# EAGLE design wifi-amp (EAGLE 7.1.0)
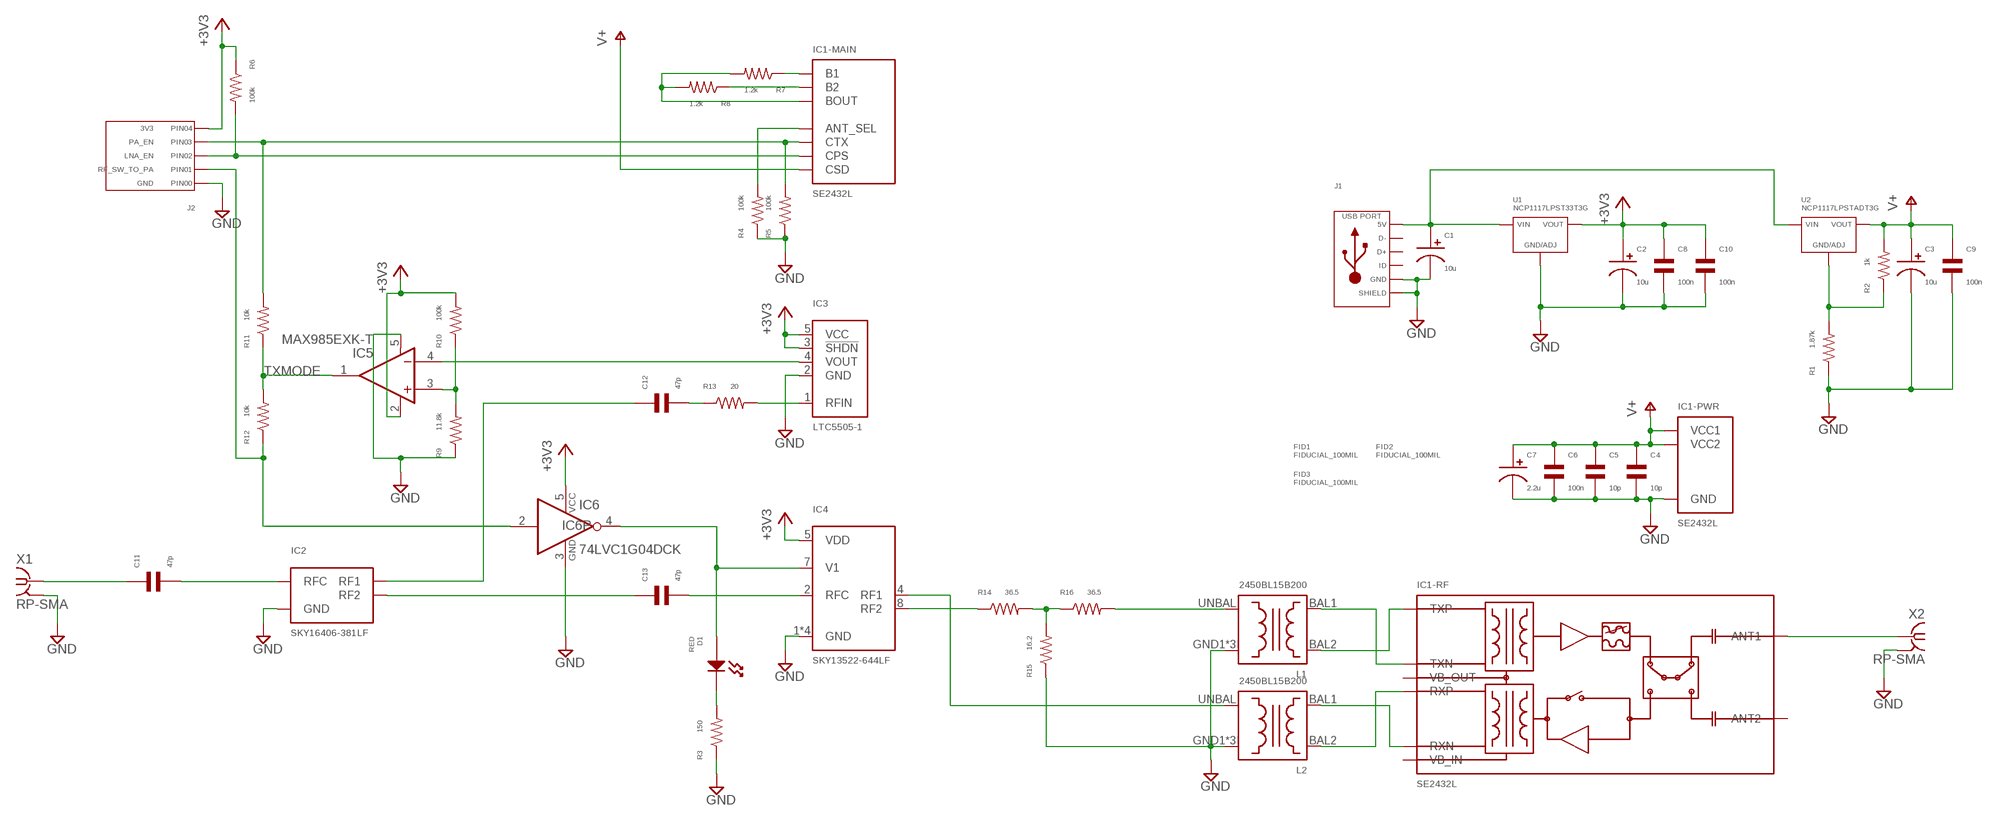
[diagram p0: schematic, sheet 1]

## Parts
C1  10u  CAPACITOR_P_4MM  [CP4MM]
C2  10u  CAPACITOR_P_4MM  [CP4MM]
C3  10u  CAPACITOR_P_4MM  [CP4MM]
C4  10p  CAPACITOR_NP_0402  [C0402]
C5  10p  CAPACITOR_NP_0402  [C0402]
C6  100n  CAPACITOR_NP_0402  [C0402]
C7  2.2u  CAPACITOR_P_4MM  [CP4MM]
C8  100n  CAPACITOR_NP_0402  [C0402]
C9  100n  CAPACITOR_NP_0402  [C0402]
C10  100n  CAPACITOR_NP_0402  [C0402]
C11  47p  CAPACITOR_NP_0402  [C0402]
C12  47p  CAPACITOR_NP_0402  [C0402]
C13  47p  CAPACITOR_NP_0402  [C0402]
D1  RED  LED_SINGLE_0603  [LED0603]
FID1  FIDUCIAL_100MIL  [FIDUCIAL_100MIL]
FID2  FIDUCIAL_100MIL  [FIDUCIAL_100MIL]
FID3  FIDUCIAL_100MIL  [FIDUCIAL_100MIL]
IC1  SE2432L  [24QFN]
IC2  SKY16406-381LF  [DFN6]
IC3  LTC5505-1  LTC5505  [SOT23-5]
IC4  SKY13522-644LF  [QFN8]
IC5  MAX985EXK-T  MAX986EXK-T  [SC70-5L]
IC6  74LVC1G04DCK  [SC70-5]
J1  USB_MICRO_RIGHT  [MICROUSB-RIGHT]
J2  HEADER_01X05_PTH_2.54MM  [PTH_2.54MM_01X05]
L1  2450BL15B200  [2450BL15B200]
L2  2450BL15B200  [2450BL15B200]
R1  1.87k  RESISTOR_0805  [R0805]
R2  1k  RESISTOR_0805  [R0805]
R3  150  RESISTOR_0402  [R0402]
R4  100k  RESISTOR_0402  [R0402]
R5  100k  RESISTOR_0402  [R0402]
R6  100k  RESISTOR_0402  [R0402]
R7  1.2k  RESISTOR_0402  [R0402]
R8  1.2k  RESISTOR_0402  [R0402]
R9  11.8k  RESISTOR_0402  [R0402]
R10  100k  RESISTOR_0402  [R0402]
R11  10k  RESISTOR_0402  [R0402]
R12  10k  RESISTOR_0402  [R0402]
R13  20  RESISTOR_0402  [R0402]
R14  36.5  RESISTOR_0402  [R0402]
R15  16.2  RESISTOR_0402  [R0402]
R16  36.5  RESISTOR_0402  [R0402]
U1  NCP1117LPST33T3G  [SOT-223-3]
U2  NCP1117LPSTADT3G  [SOT-223-3]
X1  RP-SMA  BU-SMA-H  [BU-SMA-H]
X2  RP-SMA  BU-SMA-H  [BU-SMA-H]

## Nets
+3V3: C2.P$1 C8.P$1 C10.P$1 IC3.3(!SHDN) IC3.5(VCC) IC4.5(VDD) IC5.2(V+) IC6.5(VCC) J2.P$5(PIN4) R6.P$1 R10.P$2 U1.P$1(VOUT) U1.P$3(VOUT)
+5V: C1.P$1 J1.1(5V) U1.P$4(VIN) U2.P$4(VIN)
ANT_SEL: IC1.ANT_SEL(-MAIN:ANT_SEL) R4.P$2
CPS: IC1.CPS(-MAIN:CPS) J2.P$3(PIN2) R6.P$2
CTX: IC1.CTX(-MAIN:CTX) J2.P$4(PIN3) R5.P$2 R11.P$2
GND: C1.P$2 C2.P$2 C3.P$2 C4.P$2 C5.P$2 C6.P$2 C7.P$2 C8.P$2 C9.P$2 C10.P$2 IC1.GND1(-PWR:GND) IC1.GND2(-PWR:GND) IC1.GND3(-PWR:GND) IC1.GND4(-PWR:GND) IC1.GND5(-PWR:GND) IC1.GND6(-PWR:GND) IC1.GND7(-PWR:GND) IC1.GND8(-PWR:GND) IC1.GND9(-PWR:GND) IC1.GND10(-PWR:GND) IC2.GND1(GND) IC2.GND2(GND) IC2.GND3(GND) IC2.GNDP(GND) IC3.2(GND) IC4.1(GND) IC4.3(GND) IC4.6(GND) IC4.EP(GND) IC5.5(V-) IC6.3(GND) J1.5(GND) J1.S1(SLD) J1.S2(SLD) J1.S3(SLD) J1.S4(SLD) J1.S5(SLD) J1.S6(SLD) J1.S7(SLD) J1.S8(SLD) J2.P$1(PIN0) L1.GND1(GND) L1.GND2(GND) L1.GND3(GND) L2.GND1(GND) L2.GND2(GND) L2.GND3(GND) R1.P$1 R3.P$1 R4.P$1 R5.P$1 R9.P$1 R15.P$1 U1.P$2(GND/ADJ) X1.2 X1.3 X1.4 X1.5 X2.2 X2.3 X2.4 X2.5
N$1: C11.P$1 X1.1
N$2: R1.P$2 R2.P$1 U2.P$2(GND/ADJ)
N$3: D1.CATHODE R3.P$2
N$4: IC1.B1(-MAIN:B1) R7.P$1
N$5: IC1.B2(-MAIN:B2) R8.P$1
N$6: IC1.BOUT(-MAIN:BOUT) R7.P$2 R8.P$2
N$7: IC1.ANT1(-RF:ANT1) X2.1
N$8: IC3.1(RFIN) R13.P$2
N$9: IC1.TXN(-RF:TXN) L1.BAL1
N$10: IC1.TXP(-RF:TXP) L1.BAL2
N$11: IC1.RXP(-RF:RXP) L2.BAL2
N$12: IC1.RXN(-RF:RXN) L2.BAL1
N$13: C11.P$2 IC2.RFC
N$14: C12.P$2 R13.P$1
N$15: IC4.4(RF1) L2.UNBAL
N$16: C12.P$1 IC2.RF1
N$17: C13.P$1 IC2.RF2
N$18: R14.P$2 R15.P$2 R16.P$1
N$20: IC3.4(VOUT) IC5.4(-IN)
N$21: IC5.3(+IN) R9.P$2 R10.P$1
N$22: L1.UNBAL R16.P$2
N$23: IC4.8(RF2) R14.P$1
N$24: C13.P$2 IC4.2(RFC)
N$25: D1.ANODE IC4.7(V1) IC6.4(O)
RF_SW_TO_PA: IC6.2(I) J2.P$2(PIN1) R12.P$1
TXMODE: IC5.1(OUT) R11.P$1 R12.P$2
V+: C3.P$1 C4.P$1 C5.P$1 C6.P$1 C7.P$1 C9.P$1 IC1.CSD(-MAIN:CSD) IC1.VCC1(-PWR:VCC1) IC1.VCC2(-PWR:VCC2) R2.P$2 U2.P$1(VOUT) U2.P$3(VOUT)
Unconnected: IC1.ANT2(-RF:ANT2) IC1.VB_IN(-RF:VB_IN) IC1.VB_OUT(-RF:VB_OUT) J1.2(D-) J1.3(D+) J1.4(ID)

## Library data of the parts
C1-C3 C7 = MF_Passives:CAPACITOR_P: Library: MF_Passives Description: Device for Polarized Capacitors. Manufacture part number (MFG#), Voltage Rating, and Tolerance can be added via Attributes.; MFG#: N/A; TOLERANCE: N/A; VOLTAGE: N/A
C4-C6 C8-C13 = MF_Passives:CAPACITOR_NP: Library: MF_Passives Description: Device for Non-Polarized Capacitors. Manufacture part number (MFG#), Voltage, Temperature Coefficient, and Tolerance can be added via Attributes.; MFG#: N/A; TEMP_COF: N/A; TOLERANCE: N/A; VOLTAGE: N/A
D1 = MF_LEDs:LED_SINGLE: Library: MF_LEDs Description: Device for Single LED Packages. Manufacture part number (MFG#) can be added via Attributes.; MFG#: N/A
FID1-FID3 = MF_Aesthetics:FIDUCIAL: Library: MF_Aesthetics Description: Fiducial marking for PCB alignment inside PNP and other machines.
IC1 = se2432l:SE2432L
IC2 = SKY16406-381LF:SKY16406-381LF
IC3 = LTC5505:LTC5505
IC4 = SKY13522-644LF:SKY13522-644LF
IC5 = maxim:MAX98*: Micropower, Low-Voltage Rail-to-Rail I/O Comparators Source: http://pdfserv.maxim-ic.com/en/ds/MAX985-MAX994.pdf; MPN: MAX986EXK+T; OC_FARNELL: unknown; OC_NEWARK: 67K7108
IC6 = 74xx-little-us:74*1G04: INVERTER Gate
J1 = MF_Connectors:USB: Library: MF_Connectors Description: 5 Pin USB Connectors. SLD is the shield connection. Usually tied to ground through a small ferrite bead.
J2 = MF_Connectors:HEADER_01X05: Library: MF_Connectors Description: Header Connector with 5 Positions and 01 Rows. Use the LABEL Attribute to label the pin on the schematic and PCB. You can remove the attributes on the PCB by using the SMASH function on the part and then deleting the text.; LABEL00: GND; LABEL01: RF_SW_TO_PA; LABEL02: LNA_EN; LABEL03: PA_EN; LABEL04: 3V3
L1 L2 = 2450BL15B200:2450BL15B200
R1-R3 R7-R10 R13-R16 = MF_Passives:RESISTOR: Library: MF_Passives Description: Device for Resistors. Manufacture part number (MFG#), Voltage, Tolerance, and Wattage Rating can be added via Attributes.; MFG#: N/A; TOLERANCE: 1%; VOLTAGE: N/A; WATTAGE: N/A
R4-R6 R11 R12 = MF_Passives:RESISTOR: Library: MF_Passives Description: Device for Resistors. Manufacture part number (MFG#), Voltage, Tolerance, and Wattage Rating can be added via Attributes.; MFG#: N/A; TOLERANCE: N/A; VOLTAGE: N/A; WATTAGE: N/A
U1 U2 = MF_IC_Power:NCP1117LP: Manufacturer Part #: NCP1117LP Manufacturer: ON Semiconductor Description: LDO Voltage Regulators
X1 X2 = con-coax:BU-SMA-H: FEMALE SMA CONNECTOR Radiall; OC_FARNELL: unknown; OC_NEWARK: unknown

## Board
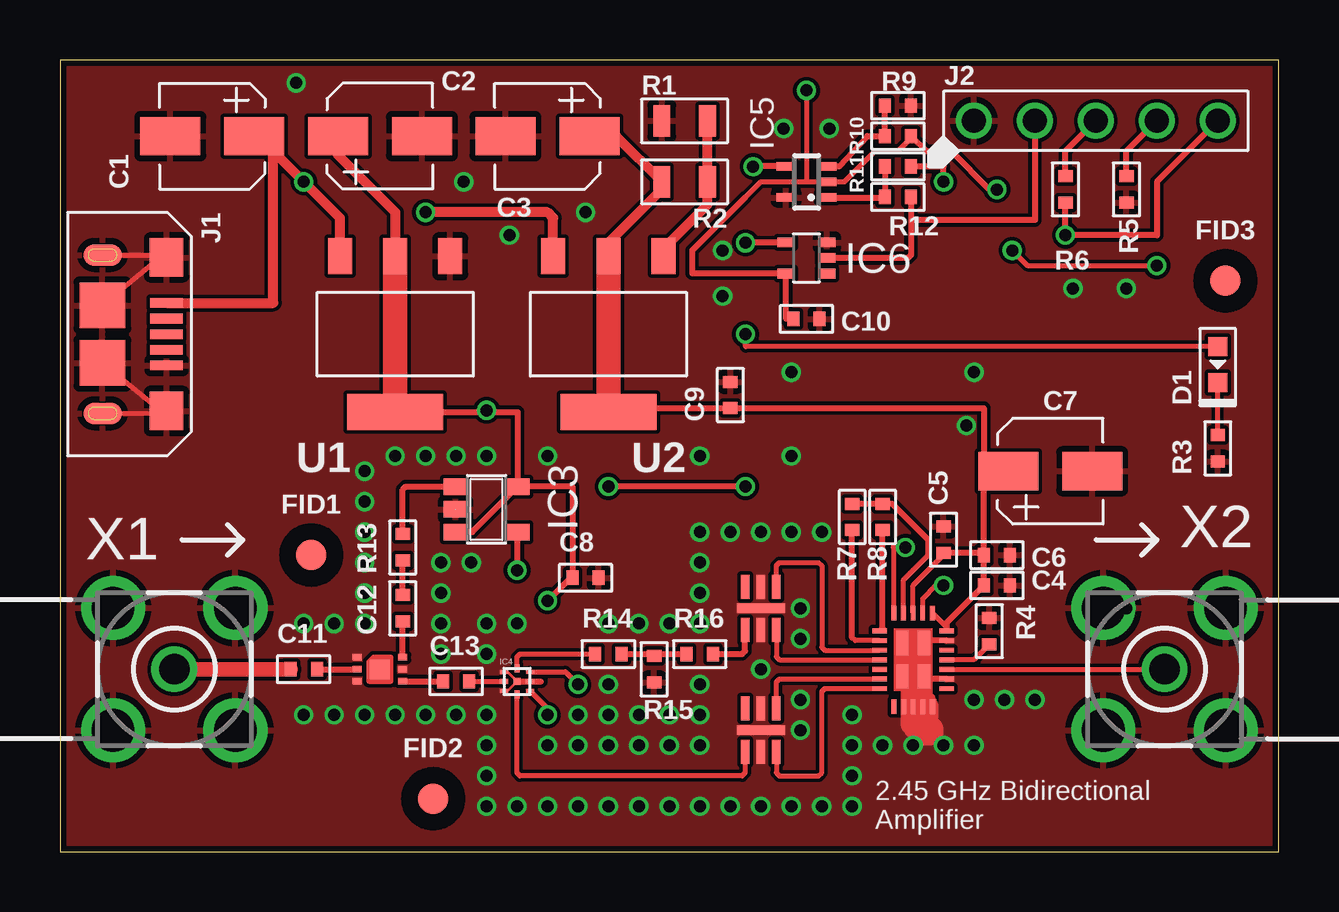
[diagram p1: board, top side]
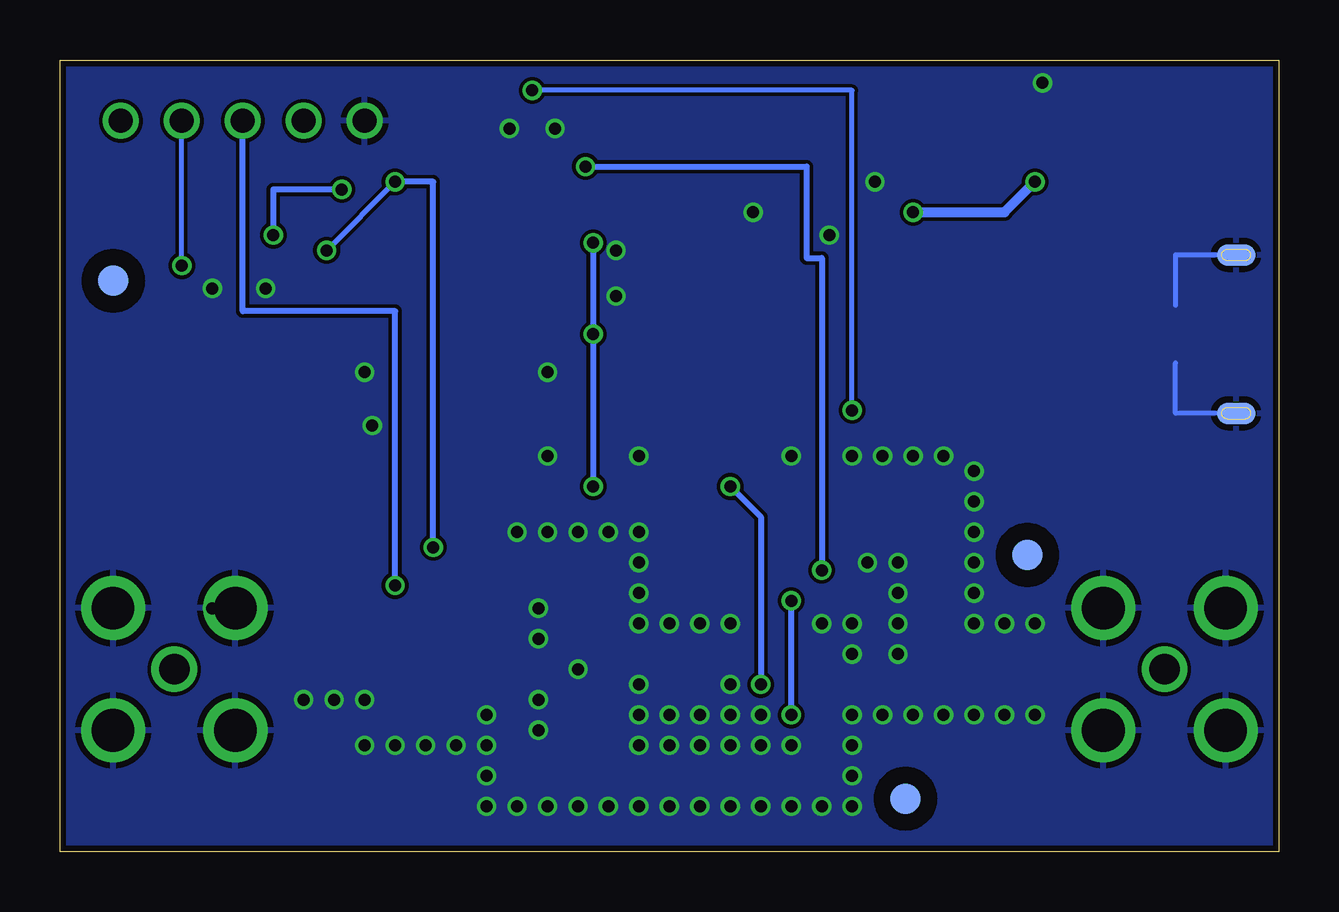
[diagram p2: board, bottom side, seen from below]

Size 50.8 x 33.02 mm. Coordinates in mm from the lower left corner, seen from the top.
Outline: 0,0 50.8,0 50.8,33.02 0,33.02 0,0
Copper layers (1*16): Top 0.035mm / dielectric 1.5mm / Bottom 0.035mm
Design rules "MF_Standard_2_Layer": minimum track width 6mil, minimum drill 12mil, track to track 6mil, track to pad 6mil, pad to pad 6mil, via to via 6mil, smd to smd 0mil, copper to edge 10mil, drill to drill 10mil, minimum pad ring 6mil, minimum via ring 6mil, stop-mask expansion 2mil, vias tented up to drill 25mil, thermal gap 10mil

### Footprints (pad centres in the part's own frame; a part is rotated, then mirrored left to right if it is on the bottom)
CP4MM = smd 1.6 x 2.5: P$1 0,-1.75; P$2 0,1.75
C0402 = smd 0.5 x 0.6: P$1 -0.55,0; P$2 0.55,0
LED0603 = smd 0.8 x 0.8: ANODE 0.75,0; CATHODE -0.75,0
FIDUCIAL_100MIL = smd 1.27 x 1.27: P$1 0,0 | smd 1.27 x 1.27 bottom: P$2 0,0
24QFN = smd 0.2 x 0.6: ANT1 0.4,1.4; ANT2 1.2,1.4; ANT_SEL 0,1.4; B1 -0.8,-1.4; B2 -1.2,-1.4; GND5 0.8,1.4; GND6 -0.8,1.4; NC -0.4,1.4; RXN 1.2,-1.4; RXP 0.8,-1.4; TXN 0,-1.4; TXP -0.4,-1.4; VB_OUT 0.4,-1.4; VCC2 -1.2,1.4 | smd 0.6 x 0.2: BOUT -1.95,-0.4; CPS -1.95,0.4; CSD -1.95,0.8; CTX -1.95,-0.8; GND1 1.95,-0.4; GND2 1.95,0; GND3 1.95,0.4; GND4 1.95,0.8; VB_IN 1.95,-0.8; VCC1 -1.95,0 | smd 1 x 0.5: GND7 -0.7,-0.45; GND8 0.7,-0.45; GND9 -0.7,0.45; GND10 0.7,0.45
DFN6 = smd 0.4 x 0.25: GND1 -0.95,0.5; GND2 -0.95,-0.5; GND3 0.95,0; RF1 0.95,0.5; RF2 0.95,-0.5; RFC -0.95,0 | smd 0.8 x 0.8: GNDP 0,0
SOT23-5 = smd 0.69 x 0.99: 1 -0.95,-1.29; 2 0,-1.29; 3 0.95,-1.29; 4 0.95,1.3; 5 -0.95,1.3
QFN8 = smd 0.325 x 0.175: 1 -0.537,0.4; 3 -0.537,-0.4; 5 0.537,-0.4; 7 0.537,0.4 | smd 0.325 x 0.2: 2 -0.537,0; 6 0.537,0 | smd 0.2 x 0.325: 4 0,-0.537; 8 0,0.537 | smd 0.29 x 0.29: EP 0,0
SC70-5L = smd 0.35 x 0.8: 1 -0.65,-0.85; 2 0,-0.85; 3 0.65,-0.85; 4 0.65,0.85; 5 -0.65,0.85
SC70-5 = smd 0.4 x 0.7: 1 -0.65,-0.85; 2 0,-0.85; 3 0.65,-0.85; 4 0.65,0.85; 5 -0.65,0.85
MICROUSB-RIGHT = smd 0.4 x 1.35: 1 -1.3,1.27; 2 -0.65,1.27; 3 0,1.27; 4 0.65,1.27; 5 1.3,1.27 | smd 0.9 x 1.6: S1 -3.3,-1.4; S2 3.3,-1.4 | smd 1.6 x 1.4: S3 -3.2,1.27; S4 3.2,1.27 | smd 1.9 x 1.9: S5 -1.2,-1.405; S6 1.2,-1.405 | smd 0.9 x 1.6 bottom: S7 -3.3,-1.4; S8 3.3,-1.4
PTH_2.54MM_01X05 = drill 1: P$1 -5.08,0; P$2 -2.54,0; P$3 0,0; P$4 2.54,0; P$5 5.08,0
2450BL15B200 = smd 0.35 x 1: BAL1 -0.65,0.9; BAL2 -0.65,-0.9; GND1 0,0.9; GND2 0,-0.9; NC 0.65,-0.9; UNBAL 0.65,0.9 | smd 2 x 0.4: GND3 0,0
R0805 = smd 0.7 x 1.3: P$1 -0.95,0; P$2 0.95,0
R0402 = smd 0.5 x 0.6: P$1 -0.55,0; P$2 0.55,0
SOT-223-3 = smd 4 x 1.5: P$1 0,3.25 | smd 1 x 1.5: P$2 -2.3,-3.25; P$3 0,-3.25; P$4 2.3,-3.25
BU-SMA-H = drill 1.27: 1 0,0 | drill 1.778: 2 -2.55,2.55; 3 2.55,2.55; 4 2.55,-2.55; 5 -2.55,-2.55

### Placement (x,y rotation side)
C1  6.35,29.84 90 top
C2  13.34,29.84 270 top
C3  20.32,29.84 90 top
C4  39.05,11.11 0 top
C5  36.83,13.02 90 top
C6  39.05,12.38 0 top
C7  41.27,15.88 270 top
C8  21.91,11.43 0 top
C9  27.94,19.05 90 top
C10  31.11,22.23 0 top
C11  10.16,7.62 0 top
C12  14.29,10.16 90 top
C13  16.51,7.11 0 top
D1  48.26,20.32 90 top
FID1  10.48,12.38 0 top
FID2  15.56,2.22 0 top
FID3  48.58,23.81 0 top
IC1  35.56,8.01 270 top
IC2  13.34,7.62 0 top
IC3  17.78,14.29 270 top
IC4  19.05,7.11 0 top
IC5  31.11,27.94 90 top
IC6  31.11,24.77 90 top
J1  3.17,21.59 270 top
J2  43.18,30.48 0 top
L1  29.21,10.16 180 top
L2  29.21,5.08 180 top
R1  26.04,30.48 0 top
R2  26.04,27.94 180 top
R3  48.26,16.83 90 top
R4  38.73,9.21 270 top
R5  44.45,27.62 90 top
R6  41.91,27.62 90 top
R7  33.02,13.97 90 top
R8  34.29,13.97 90 top
R9  34.92,31.11 180 top
R10  34.92,29.84 0 top
R11  34.92,28.57 0 top
R12  34.92,27.3 180 top
R13  14.29,12.7 90 top
R14  22.86,8.26 0 top
R15  24.77,7.62 90 top
R16  26.67,8.26 0 top
U1  13.97,21.59 180 top
U2  22.86,21.59 180 top
X1  4.76,7.62 180 top
X2  46.04,7.62 0 top

### Tracks (layer width: path | path; a pad name or v marks a point on that pad's centre or on a via)
+3V3  (via drill 0.5)
  Top 0.203: IC4.5 20.32,5.98 | 28.56,27.29 29.21,27.94 31.11,27.94 | 31.11,27.94 IC5.2 32.7,27.94 33.97,29.21 34.92,29.21 35.48,29.76 R10.P$2 | 19.08,18.34 17.78,18.34 v17.78,18.41 | v31.11,31.75 31.11,27.94
  Top 0.254: 20.32,5.98 v20.32,5.71 | J2.P$5 45.72,27.94 45.72,25.72 v41.91,25.72 R6.P$1 | R10.P$2 36.11,29.21 37.15,29.21 38.73,27.62 v39.05,27.62 | C10.P$1 30.27,22.23 IC6.5 26.35,24.13 26.35,25.08 28.56,27.29 | v20.32,10.48 21.27,11.43 C8.P$1 21.36,15.24 IC3.5 | IC3.5 17.18,13.34 IC3.3 | U1.P$1 19.08,18.34 IC3.5
  Top 0.406: C2.P$1 11.59,29.05 13.97,26.67 U1.P$3
  Top 1.016: U1.P$3 U1.P$1
  Bottom 0.203: v17.78,18.41 17.78,31.75 v31.11,31.75
  Bottom 0.254: v20.32,5.71 v20.32,10.48 | v39.05,27.62 41.91,27.62 v41.91,25.72
+5V  (via drill 0.5)
  Top 0.406: J1.1 8.89,22.89 8.89,29.21 | 8.89,29.21 8.89,29.84 C1.P$1 | U1.P$4 11.67,26.43 v10.16,27.94 8.89,29.21 | U2.P$4 20.56,26.43 20.32,26.67 v15.24,26.67
  Bottom 0.406: v15.24,26.67 11.43,26.67 v10.16,27.94
ANT_SEL
  Top 0.203: R4.P$2 38.09,8.01 IC1.ANT_SEL
CPS  (via drill 0.5)
  Top 0.203: IC1.CPS 35.96,10.56 36.51,11.11
  Top 0.254: R6.P$2 41.91,29.21 J2.P$3 | 36.51,11.11 v36.83,11.11
  Bottom 0.254: v36.83,11.11 36.83,22.54 43.18,22.54 J2.P$3
CTX  (via drill 0.5)
  Top 0.203: IC1.CTX 34.76,12.7 | v39.69,25.08 40.32,24.45 v45.72,24.45
  Top 0.254: 34.76,12.7 v35.24,12.7 | v36.83,27.94 36.83,28.57 R11.P$2 | R5.P$2 44.45,29.21 J2.P$4
  Bottom 0.203: v36.83,27.94 v39.69,25.08 | v45.72,24.45 J2.P$4
  Bottom 0.254: v35.24,12.7 35.24,27.94 v36.83,27.94
GND  (via drill 0.5)
  Top 0.203: J1.S8 4.31,18.3 J1.S6 | J1.S7 4.31,24.89 J1.S5
  Top 0.254: IC1.GND7 IC1.GND9 36.11,8.81 IC1.GND6 | IC1.GND5 36.11,7.21 IC1.GND10 IC1.GND8 | IC1.GND4 IC1.GND3 | IC1.GND2 IC1.GND1
  Top 1.016: IC1.GND2 35.56,5.33 35.69,5.21 35.96,5.21
  Top 1.27: IC1.GND3 35.96,5.21 36.09,5.08 36.2,5.08
  Bottom 0.203: J1.S8 4.31,18.3 4.31,20.39 | J1.S7 4.31,24.89 4.31,22.79
  other vias: 29.21,7.62 30.86,8.89 30.86,6.35 30.86,10.16 30.86,5.08 21.59,5.71 22.86,6.99 22.86,9.53 26.67,9.53 26.67,5.71 24.13,5.71 22.86,5.71 25.4,5.71 24.13,9.53 20.32,4.45 21.59,4.45 22.86,4.45 24.13,4.45 25.4,4.45 26.67,6.99 25.4,9.53 19.05,9.53 17.78,5.71 17.78,4.45 17.78,3.17 20.32,1.91 19.05,1.91 17.78,1.91 21.59,1.91 22.86,1.91 24.13,1.91 25.4,1.91 26.67,1.91 27.94,1.91 29.21,1.91 30.48,1.91 26.67,4.45 31.75,1.91 33.02,1.91 33.02,3.17 33.02,4.45 33.02,5.71 34.29,4.45 35.56,4.45 36.83,4.45 38.1,4.45 38.1,6.35 39.37,6.35 40.64,6.35 16.51,5.71 15.24,5.71 13.97,5.71 12.7,5.71 11.43,5.71 10.16,5.71 11.43,9.53 26.67,10.79 26.67,12.06 26.67,13.34 27.94,13.34 29.21,13.34 30.48,13.34 17.78,8.26 15.88,8.26 15.88,9.53 15.88,10.79 15.88,12.06 12.7,9.53 12.7,10.79 12.7,12.06 12.7,13.34 12.7,14.61 12.7,15.88 13.97,16.51 15.24,16.51 16.51,16.51 17.78,16.51 17.78,9.53 44.45,10.16 31.75,13.34 17.14,12.06 20.32,16.51 16.83,27.94 21.91,26.67 26.67,16.51 30.48,16.51 30.48,20 38.1,20 42.23,23.5 44.45,23.5 30.16,30.16 32.07,30.16 27.62,25.08 27.62,23.18 18.73,25.72 9.84,32.07 37.78,17.78 10.16,9.53
  pour Bottom: 0,0 50.8,0 50.8,33.02 0,33.02
  pour Top: 0,33.02 50.8,33.02 50.8,0 0,0
N$1
  Top 0.61: X1.1 C11.P$1
N$2
  Top 0.406: U2.P$2 25.16,25.16 26.98,26.98 R2.P$1 R1.P$2
N$3
  Top 0.203: R3.P$2 D1.CATHODE
N$4
  Top 0.203: IC1.B1 33.15,8.81 33.02,8.94
  Top 0.254: 33.02,8.94 R7.P$1
N$5
  Top 0.203: IC1.B2 34.29,9.34
  Top 0.254: 34.29,9.34 R8.P$1
N$6
  Top 0.203: IC1.BOUT 35.16,11.35 36.2,12.38
  Top 0.254: R7.P$2 R8.P$2 34.69,14.52 36.2,13.02 36.2,12.38
N$7
  Top 0.203: IC1.ANT1 41.88,7.61 X2.1
N$8
  Top 0.254: R13.P$2 14.29,15.11 14.41,15.24 IC3.1
N$9
  Top 0.203: L1.BAL1 29.86,8.14 29.99,8.01 IC1.TXN
N$10
  Top 0.203: L1.BAL2 29.86,11.94 29.99,12.06 31.62,12.06 31.75,11.94 31.75,8.54 31.88,8.41 IC1.TXP
N$11
  Top 0.203: L2.BAL2 29.86,7.09 29.99,7.21 IC1.RXP
N$12
  Top 0.203: L2.BAL1 29.86,3.3 29.99,3.17 31.62,3.17 31.75,3.3 31.75,6.69 31.88,6.81 IC1.RXN
N$13
  Top 0.254: C11.P$2 IC2.RFC
N$14
  Top 0.254: C12.P$2 R13.P$1
N$15
  Top 0.203: L2.UNBAL 28.56,3.3 28.43,3.17 19.18,3.17 19.05,3.3 IC4.4
N$16
  Top 0.254: IC2.RF1 C12.P$1
N$17
  Top 0.254: IC2.RF2 C13.P$1
N$18
  Top 0.254: R14.P$2 24.85,8.26 | 24.85,8.26 R16.P$1 | R15.P$2 24.85,8.26
N$20  (via drill 0.5)
  Top 0.254: IC5.4 28.89,28.59 v28.89,28.57 | v19.05,11.75 19.08,11.75 IC3.4
  Bottom 0.254: v28.89,28.57 19.68,28.57 19.68,24.77 19.05,24.77 v19.05,11.75
N$21
  Top 0.254: IC5.3 32.48,28.59 33.66,29.84 R10.P$1 R9.P$2
N$22
  Top 0.254: R16.P$2 28.43,8.26 28.56,8.38 L1.UNBAL
N$23
  Top 0.203: IC4.8 19.05,8.13 19.18,8.26 R14.P$1
N$24
  Top 0.203: C13.P$2 IC4.2
N$25  (via drill 0.5)
  Top 0.203: IC4.7 21.06,7.51 v21.59,6.99 | D1.ANODE 28.57,21.07 v28.57,21.59
  Top 0.254: IC6.4 28.57,25.41 v28.57,25.4 | v28.57,15.24 v22.86,15.24
  Bottom 0.254: v28.57,25.4 v28.57,21.59 v28.57,15.24 | v22.86,15.24 21.59,13.97 v21.59,6.99
RF_SW_TO_PA
  Top 0.254: R12.P$1 35.48,26.35 | 35.48,26.35 35.48,24.89 35.35,24.77 IC6.2 | 35.48,26.35 40.64,26.35 J2.P$2
TXMODE
  Top 0.254: IC5.1 34.36,27.29 R12.P$2 R11.P$1
V+
  Top 0.203: IC1.VCC1 35.56,11.11 36.83,12.38 | IC1.CSD 36.96,9.36 IC1.VCC2 36.96,9.57
  Top 0.254: 36.83,12.38 C5.P$1 38.5,12.47 | 36.96,9.57 C4.P$1 C6.P$1 38.5,12.47 | 38.5,12.47 38.5,15.88 | 38.5,15.88 C7.P$1 | U2.P$1 22.86,18.5 C9.P$1 38.5,18.5 38.5,15.88
  Top 0.406: C3.P$1 23.18,29.84 R2.P$2 25.09,27.62 22.86,25.4 U2.P$3
  Top 1.016: U2.P$3 U2.P$1

### Text on the board
tNames: 2.45 GHz Bidirectional / Amplifier